# Altium schematic sheet 5V_A.SchDoc
size A4
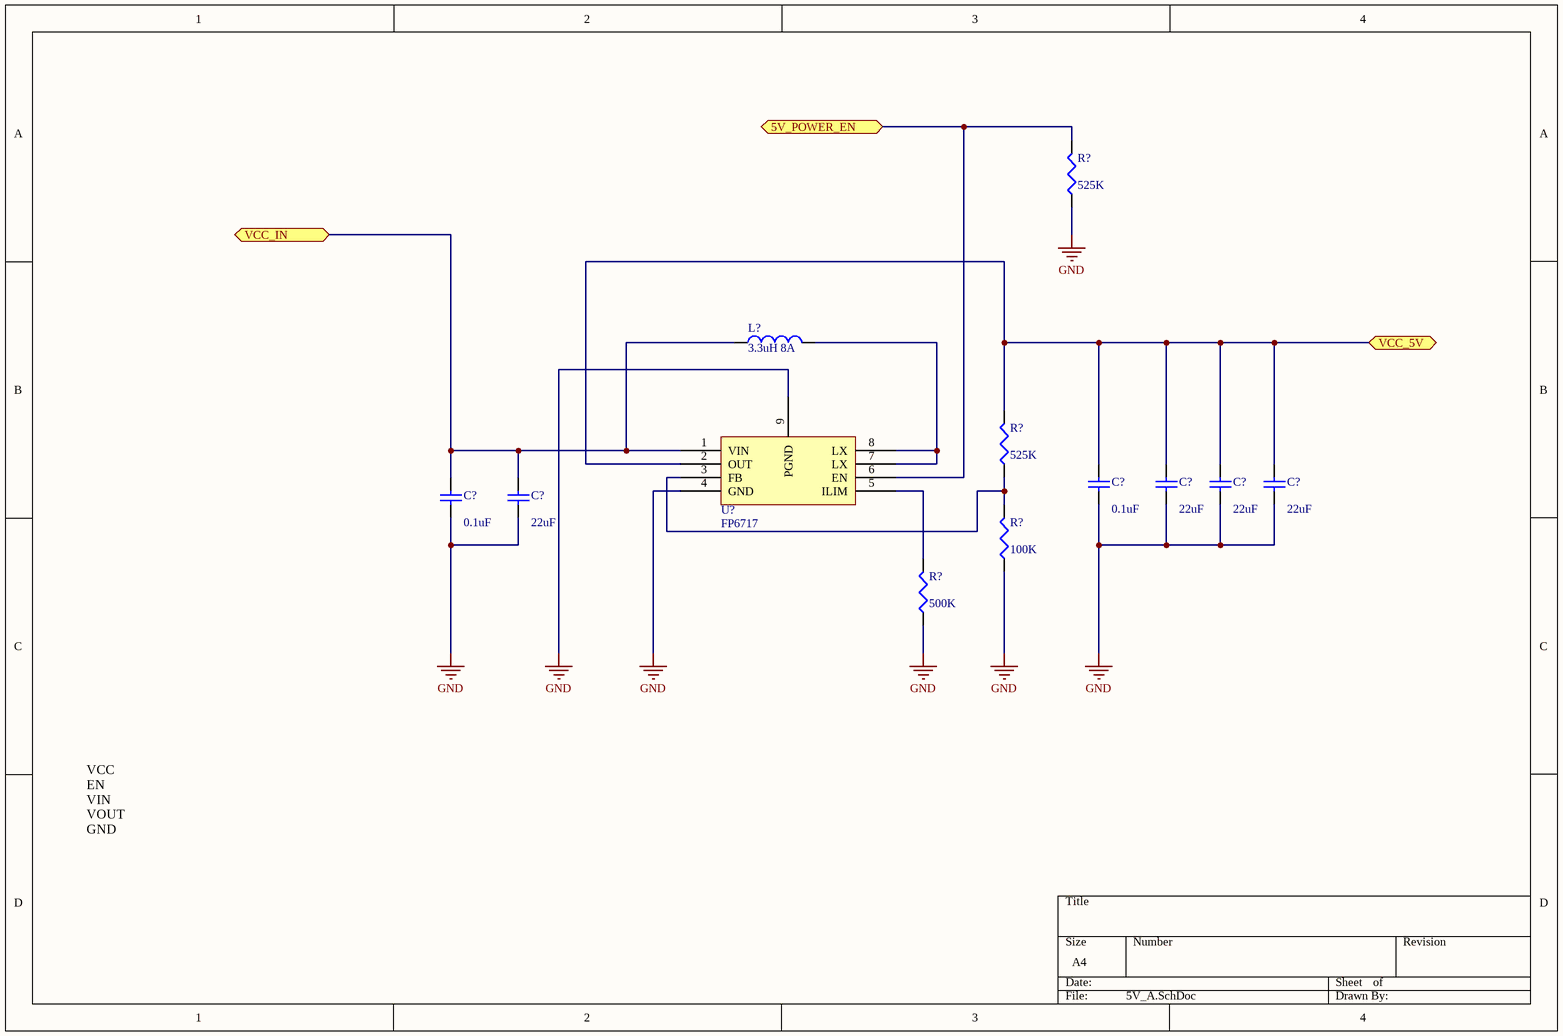
[diagram p0: 5V_A.SchDoc]

## Parts
(Parts that share a designator on the sheet are numbered #1, #2 ... from top to bottom, then left to right.)
C?#1  value 0.1uF  [C1206]  (hidden comment: Cap Semi)
C?#2  value 22uF  [C1206]  (hidden comment: Cap Semi)
C?#3  value 22uF  [C1206]  (hidden comment: Cap Semi)
C?#4  value 22uF  [C1206]  (hidden comment: Cap Semi)
C?#5  value 0.1uF  [C1206]  (hidden comment: Cap Semi)
C?#6  value 22uF  [C1206]  (hidden comment: Cap Semi)
L?  value 3.3uH 8A  [0402-A]  (hidden comment: Inductor)
R?#1  value 525K  [12Z-2010]  (hidden comment: Res3)
R?#2  value 525K  [12Z-2010]  (hidden comment: Res3)
R?#3  value 100K  [12Z-2010]  (hidden comment: Res3)
R?#4  value 500K  [12Z-2010]  (hidden comment: Res3)
U?  FP6717

## Ports
5V_POWER_EN (bidir), VCC_5V (bidir), VCC_IN (bidir)

## Nets
GND: C?#1.1 C?#2.1 C?#3.1 C?#4.1 C?#5.1 C?#6.1 R?#1.1 R?#3.1 R?#4.1 U?.4(GND) U?.9(PGND)
5V_POWER_EN: R?#1.2 U?.6(EN) ; port 5V_POWER_EN
VCC_5V: C?#1.2 C?#2.2 C?#3.2 C?#4.2 R?#2.2 U?.2(OUT) ; port VCC_5V
VCC_IN: C?#5.2 C?#6.2 L?.1 U?.1(VIN) ; port VCC_IN
NetL?_2: L?.2 U?.7(LX) U?.8(LX)
NetR?#2_1: R?#2.1 R?#3.2 U?.3(FB)
NetR?#4_2: R?#4.2 U?.5(ILIM)

## Notes on the sheet
- VCC
  EN
  VIN
  VOUT
  GND

## Library data of the parts
C?#1-C?#6 = Cap Semi: Capacitor (Semiconductor SIM Model); Published: 8-Jun-2000; LatestRevisionDate: 29-May-2009; LatestRevisionNote: IPC-7351 Footprint Added.; PackageReference: C1206; Publisher: Altium Limited; PackageDescription: Chip Capacitor
L? = Inductor: Code_IEC: 1005; Published: 8-Jun-2000; LatestRevisionDate: 29-May-2009; LatestRevisionNote: IPC-7351 Footprint Added.; PackageReference: 0402-A; Publisher: Altium Limited; PackageDescription: Chip Inductor; Code_JEITA: 0402
R?#1-R?#4 = Res3: Resistor; Published: 8-Jun-2000; LatestRevisionDate: 29-May-2009; LatestRevisionNote: IPC-7351 Footprint Added.; PackageReference: J1-0603; Publisher: Altium Limited; PackageDescription: Chip Resistor